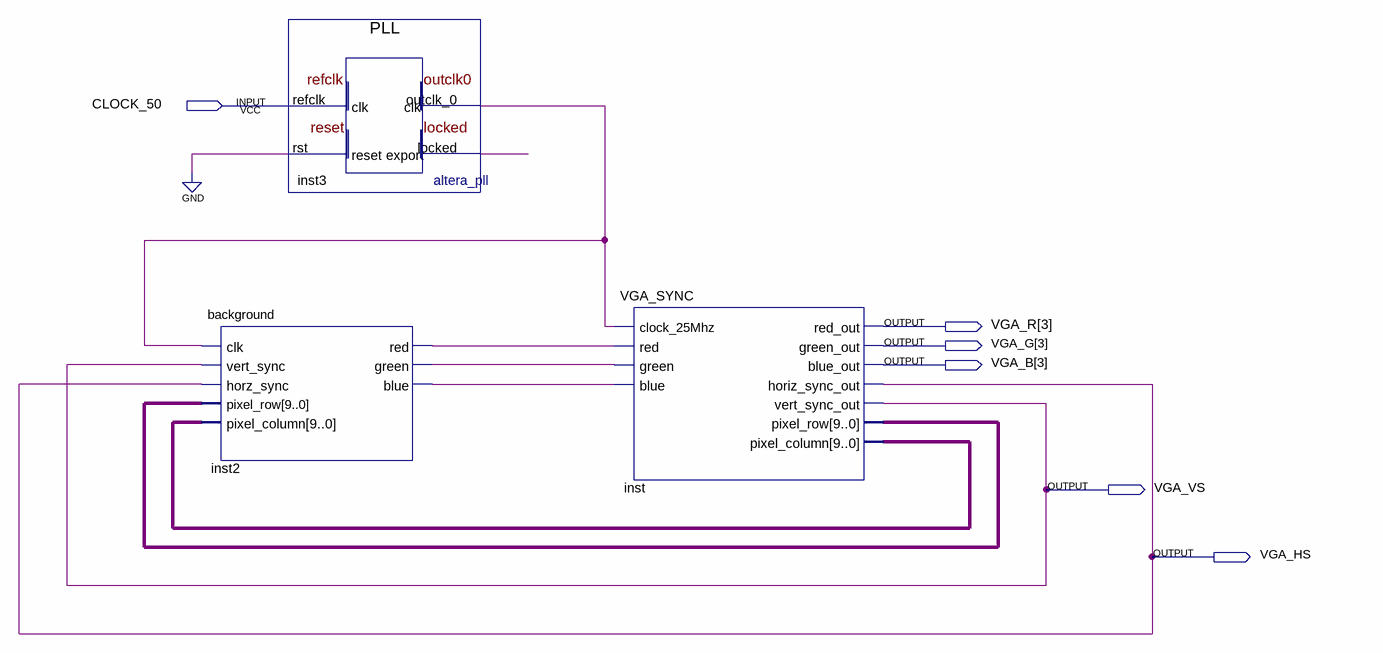
[diagram p0: schematic sheet]
// Quartus schematic background_block.bdf as structural Verilog: 3 symbols, 6 pins
module background_block (
  input  CLOCK_50,
  output [3:3] VGA_R,
  output [3:3] VGA_G,
  output [3:3] VGA_B,
  output VGA_VS,
  output VGA_HS
);

  wire inst2_blue, inst2_green, inst2_red, inst3_locked, inst3_outclk_0;
  wire [9:0] inst_pixel_column, inst_pixel_row;

  background inst2 (
    .clk(inst3_outclk_0), .vert_sync(VGA_VS), .horz_sync(VGA_HS), .pixel_row(inst_pixel_row),
    .pixel_column(inst_pixel_column), .red(inst2_red), .green(inst2_green), .blue(inst2_blue));
  PLL inst3 (.refclk(CLOCK_50), .rst(1'b0), .outclk_0(inst3_outclk_0), .locked(inst3_locked));
  VGA_SYNC inst (
    .clock_25Mhz(inst3_outclk_0), .red(inst2_red), .green(inst2_green), .blue(inst2_blue),
    .red_out(VGA_R[3]), .green_out(VGA_G[3]), .blue_out(VGA_B[3]), .horiz_sync_out(VGA_HS),
    .vert_sync_out(VGA_VS), .pixel_row(inst_pixel_row), .pixel_column(inst_pixel_column));
endmodule
